# EAGLE design Schematic (EAGLE 5.06)

## Sheet 1 of 3
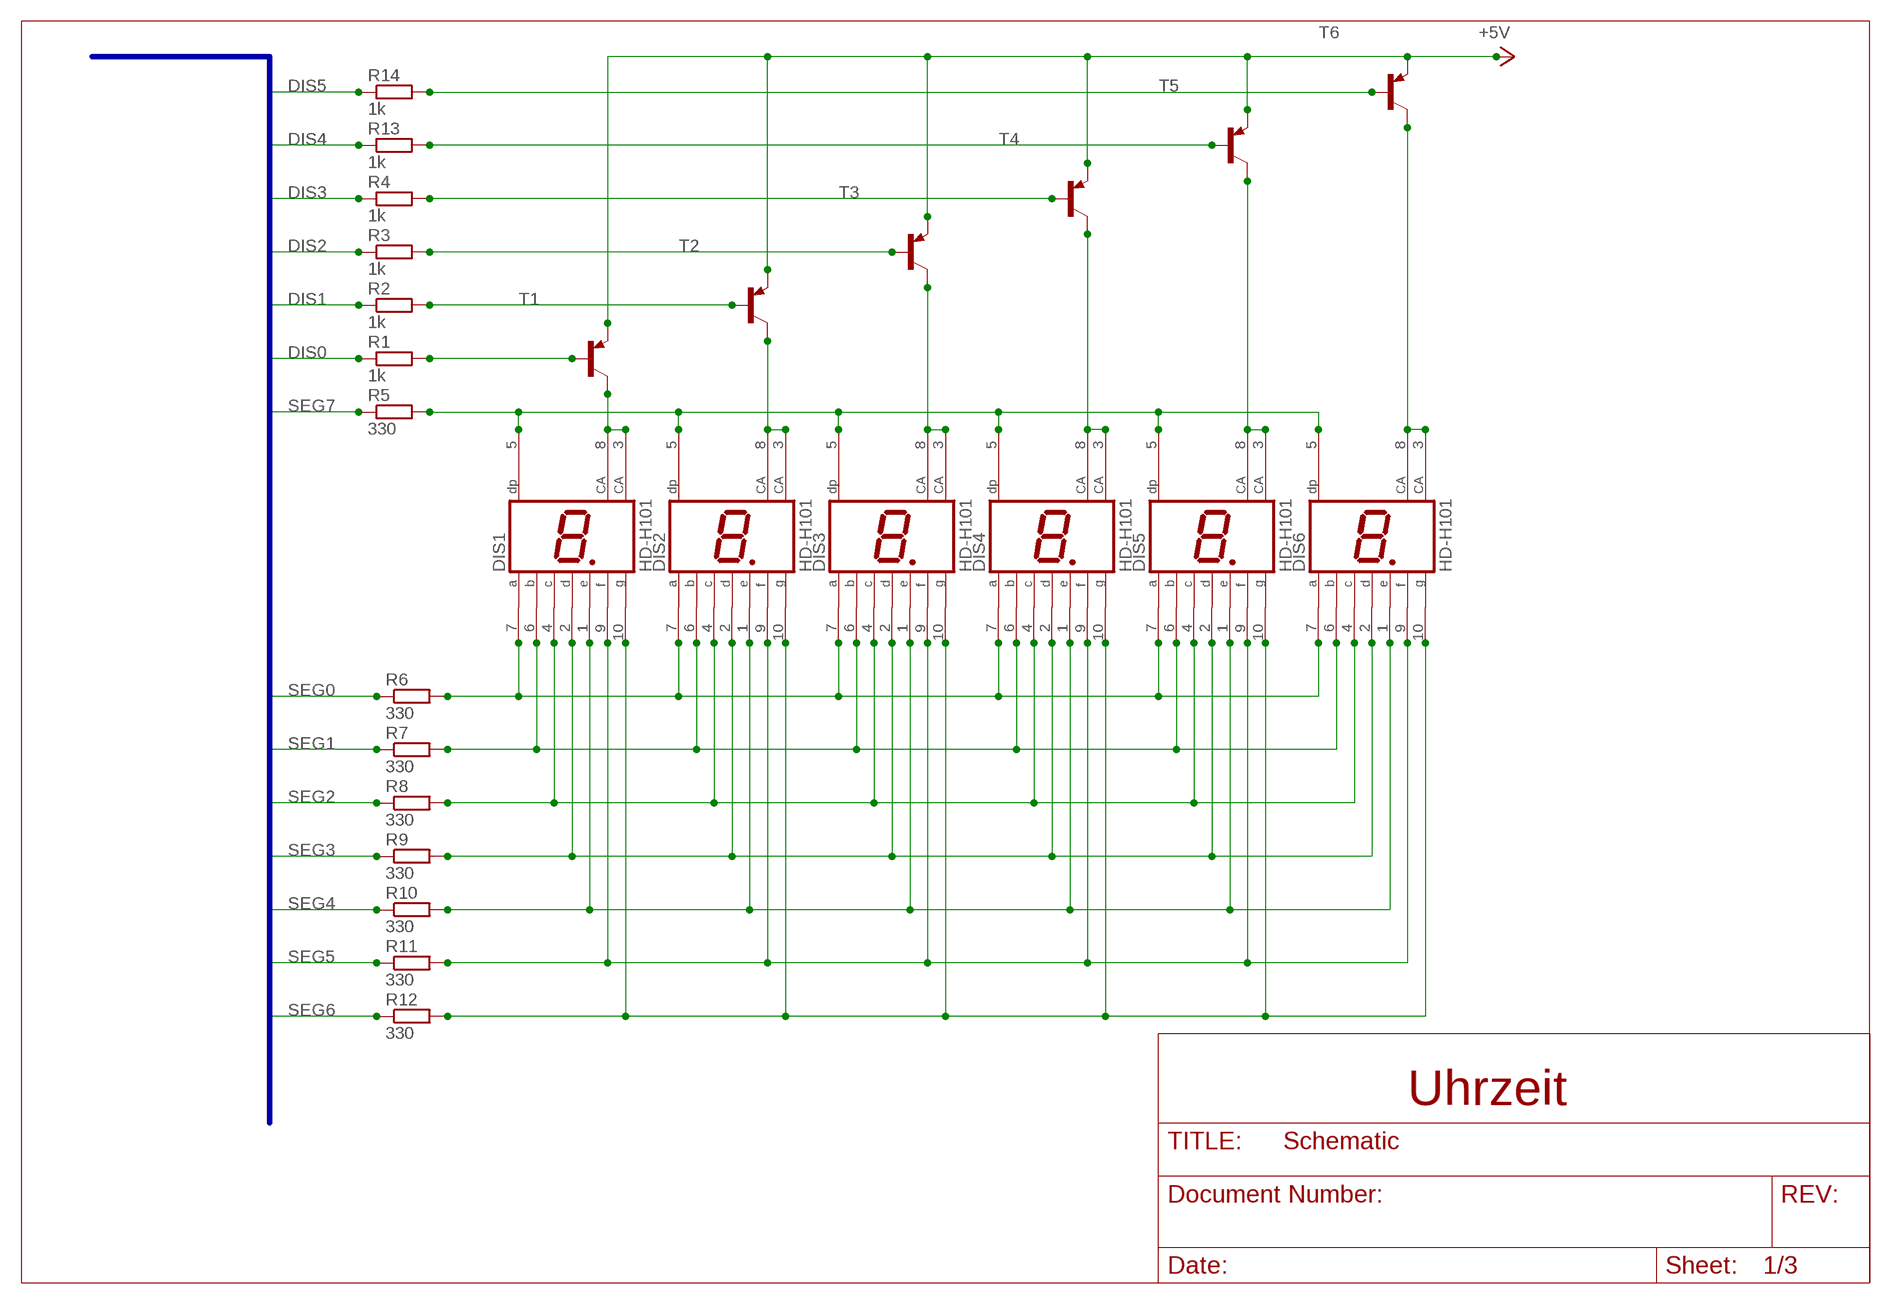
[diagram p0: schematic, sheet 1]

### Parts
DIS1  HD-H101  [HDSP-M]
DIS2  HD-H101  [HDSP-M]
DIS3  HD-H101  [HDSP-M]
DIS4  HD-H101  [HDSP-M]
DIS5  HD-H101  [HDSP-M]
DIS6  HD-H101  [HDSP-M]
R1  1k  R-EU_R1206  [R1206]
R2  1k  R-EU_R1206  [R1206]
R3  1k  R-EU_R1206  [R1206]
R4  1k  R-EU_R1206  [R1206]
R5  330  R-EU_R1206  [R1206]
R6  330  R-EU_R1206  [R1206]
R7  330  R-EU_R1206  [R1206]
R8  330  R-EU_R1206  [R1206]
R9  330  R-EU_R1206  [R1206]
R10  330  R-EU_R1206  [R1206]
R11  330  R-EU_R1206  [R1206]
R12  330  R-EU_R1206  [R1206]
R13  1k  R-EU_R1206  [R1206]
R14  1k  R-EU_R1206  [R1206]
T1  BC857B-PNP-SOT23-BEC  [SOT23-BEC]
T2  BC857B-PNP-SOT23-BEC  [SOT23-BEC]
T3  BC857B-PNP-SOT23-BEC  [SOT23-BEC]
T4  BC857B-PNP-SOT23-BEC  [SOT23-BEC]
T5  BC857B-PNP-SOT23-BEC  [SOT23-BEC]
T6  BC857B-PNP-SOT23-BEC  [SOT23-BEC]

### Nets
+5V: T1.E T2.E T3.E T4.E T5.E T6.E ; also sheet 2,3
DIS0: R1.1 ; also sheet 3
DIS1: R2.1 ; also sheet 3
DIS2: R3.1 ; also sheet 3
DIS3: R4.1 ; also sheet 3
DIS4: R13.1 ; also sheet 3
DIS5: R14.1 ; also sheet 3
N$1: DIS1.3(CA) DIS1.8(CA) T1.C
N$3: DIS2.3(CA) DIS2.8(CA) T2.C
N$5: R4.2 T4.B
N$6: R3.2 T3.B
N$7: R2.2 T2.B
N$8: R1.2 T1.B
N$9: DIS3.3(CA) DIS3.8(CA) T3.C
N$10: DIS1.7(A) DIS2.7(A) DIS3.7(A) DIS4.7(A) DIS5.7(A) DIS6.7(A) R6.2
N$11: DIS1.4(C) DIS2.4(C) DIS3.4(C) DIS4.4(C) DIS5.4(C) DIS6.4(C) R8.2
N$12: DIS1.6(B) DIS2.6(B) DIS3.6(B) DIS4.6(B) DIS5.6(B) DIS6.6(B) R7.2
N$13: DIS1.2(D) DIS2.2(D) DIS3.2(D) DIS4.2(D) DIS5.2(D) DIS6.2(D) R9.2
N$14: DIS1.1(E) DIS2.1(E) DIS3.1(E) DIS4.1(E) DIS5.1(E) DIS6.1(E) R10.2
N$15: DIS1.9(F) DIS2.9(F) DIS3.9(F) DIS4.9(F) DIS5.9(F) DIS6.9(F) R11.2
N$16: DIS1.10(G) DIS2.10(G) DIS3.10(G) DIS4.10(G) DIS5.10(G) DIS6.10(G) R12.2
N$18: DIS4.3(CA) DIS4.8(CA) T4.C
N$19: DIS1.5(DP) DIS2.5(DP) DIS3.5(DP) DIS4.5(DP) DIS5.5(DP) DIS6.5(DP) R5.2
N$20: R14.2 T6.B
N$21: R13.2 T5.B
N$23: DIS5.3(CA) DIS5.8(CA) T5.C
N$25: DIS6.3(CA) DIS6.8(CA) T6.C
SEG0: R6.1 ; also sheet 3
SEG1: R7.1 ; also sheet 3
SEG2: R8.1 ; also sheet 3
SEG3: R9.1 ; also sheet 3
SEG4: R10.1 ; also sheet 3
SEG5: R11.1 ; also sheet 3
SEG6: R12.1 ; also sheet 3
SEG7: R5.1 ; also sheet 3

### Buses
DIS[0..5],SEG[0..7]

### Notes on the sheet
- Uhrzeit

## Sheet 2 of 3
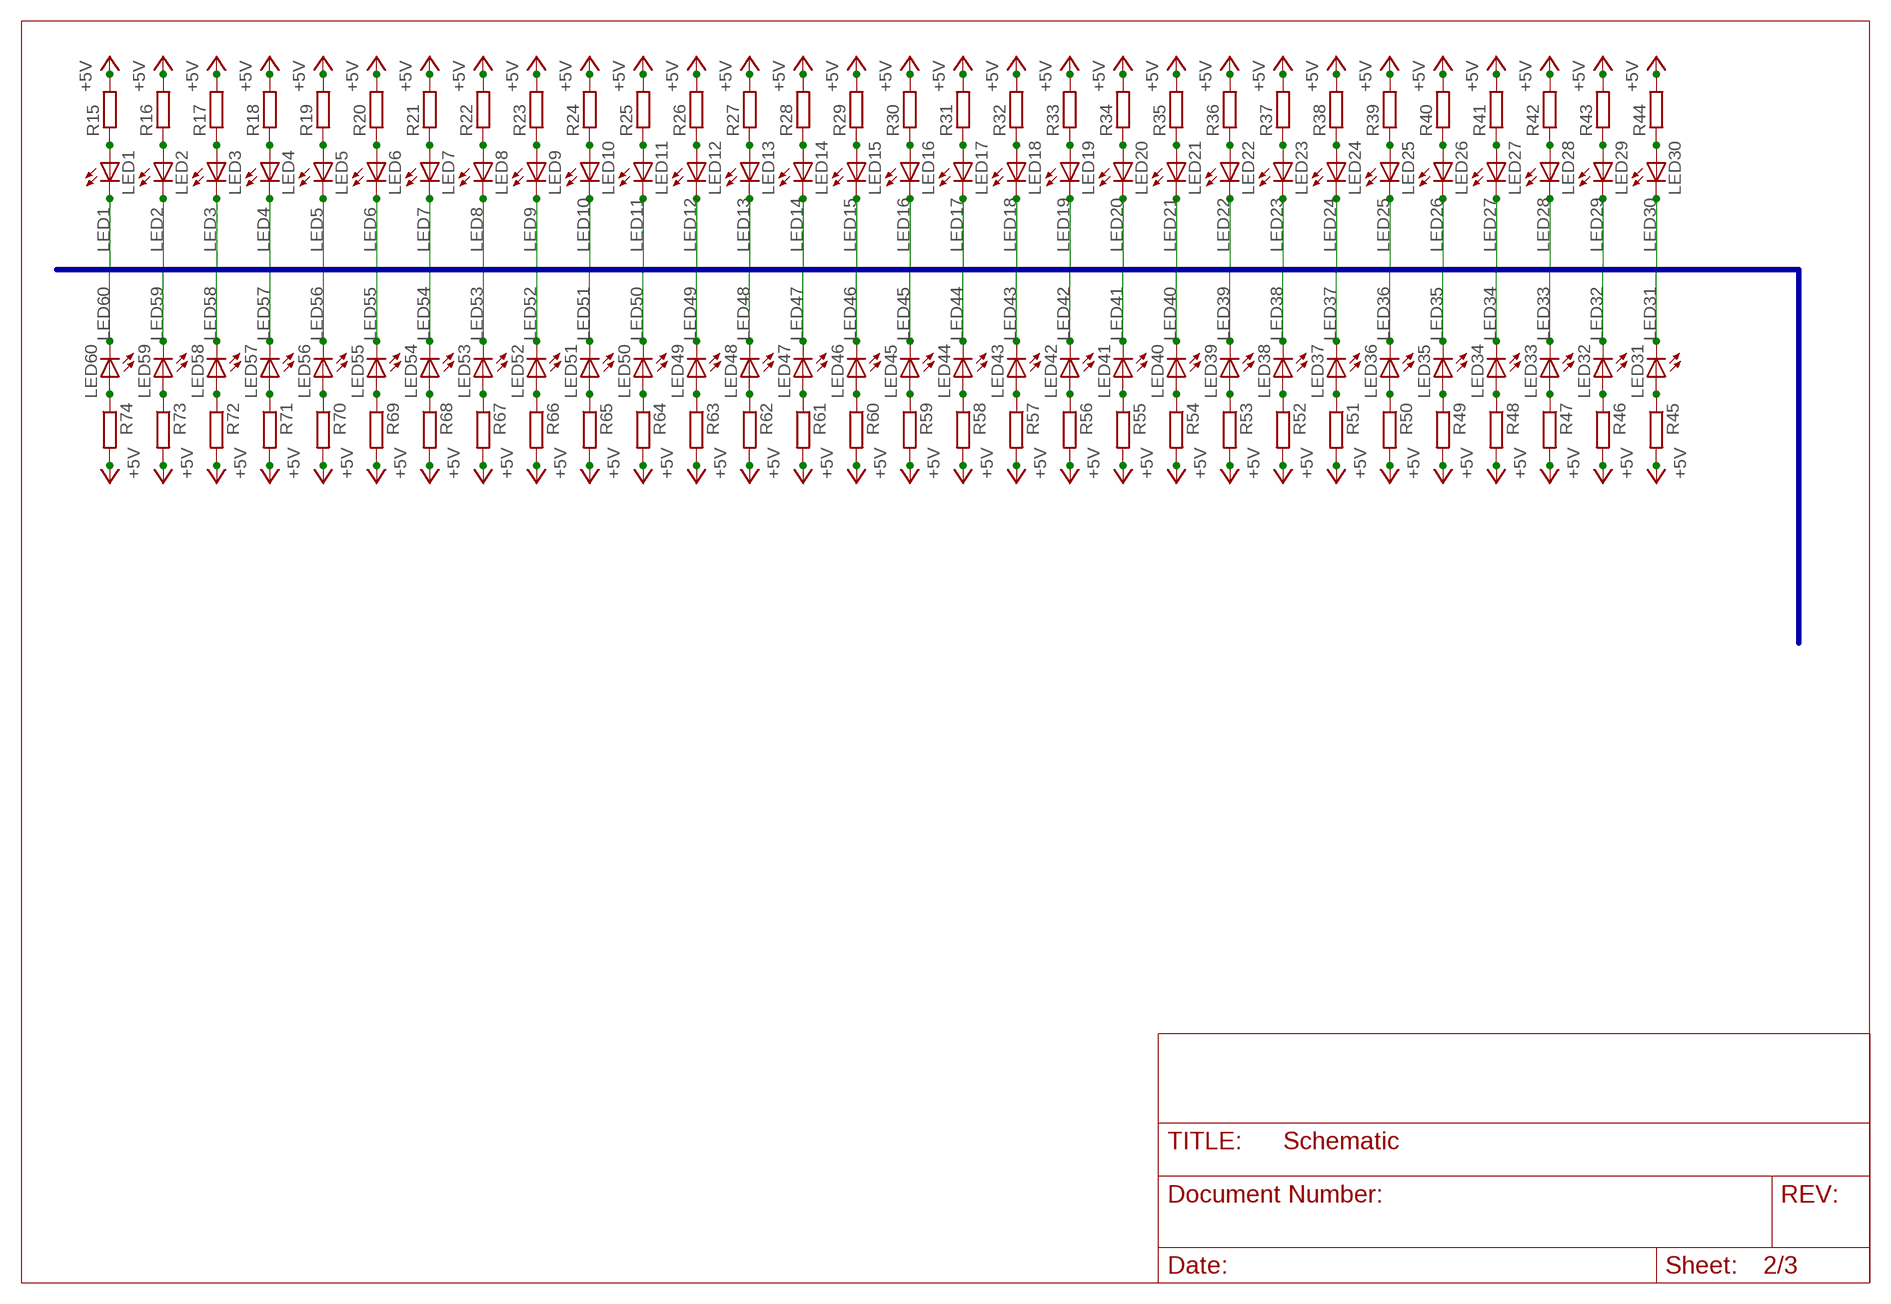
[diagram p1: schematic, sheet 2]

### Parts
LED1  T673  [PLCC2]
LED2  T673  [PLCC2]
LED3  T673  [PLCC2]
LED4  T673  [PLCC2]
LED5  T673  [PLCC2]
LED6  T673  [PLCC2]
LED7  T673  [PLCC2]
LED8  T673  [PLCC2]
LED9  T673  [PLCC2]
LED10  T673  [PLCC2]
LED11  T673  [PLCC2]
LED12  T673  [PLCC2]
LED13  T673  [PLCC2]
LED14  T673  [PLCC2]
LED15  T673  [PLCC2]
LED16  T673  [PLCC2]
LED17  T673  [PLCC2]
LED18  T673  [PLCC2]
LED19  T673  [PLCC2]
LED20  T673  [PLCC2]
LED21  T673  [PLCC2]
LED22  T673  [PLCC2]
LED23  T673  [PLCC2]
LED24  T673  [PLCC2]
LED25  T673  [PLCC2]
LED26  T673  [PLCC2]
LED27  T673  [PLCC2]
LED28  T673  [PLCC2]
LED29  T673  [PLCC2]
LED30  T673  [PLCC2]
LED31  T673  [PLCC2]
LED32  T673  [PLCC2]
LED33  T673  [PLCC2]
LED34  T673  [PLCC2]
LED35  T673  [PLCC2]
LED36  T673  [PLCC2]
LED37  T673  [PLCC2]
LED38  T673  [PLCC2]
LED39  T673  [PLCC2]
LED40  T673  [PLCC2]
LED41  T673  [PLCC2]
LED42  T673  [PLCC2]
LED43  T673  [PLCC2]
LED44  T673  [PLCC2]
LED45  T673  [PLCC2]
LED46  T673  [PLCC2]
LED47  T673  [PLCC2]
LED48  T673  [PLCC2]
LED49  T673  [PLCC2]
LED50  T673  [PLCC2]
LED51  T673  [PLCC2]
LED52  T673  [PLCC2]
LED53  T673  [PLCC2]
LED54  T673  [PLCC2]
LED55  T673  [PLCC2]
LED56  T673  [PLCC2]
LED57  T673  [PLCC2]
LED58  T673  [PLCC2]
LED59  T673  [PLCC2]
LED60  T673  [PLCC2]
R15  R-EU_M1206  [M1206]
R16  R-EU_M1206  [M1206]
R17  R-EU_M1206  [M1206]
R18  R-EU_M1206  [M1206]
R19  R-EU_M1206  [M1206]
R20  R-EU_M1206  [M1206]
R21  R-EU_M1206  [M1206]
R22  R-EU_M1206  [M1206]
R23  R-EU_M1206  [M1206]
R24  R-EU_M1206  [M1206]
R25  R-EU_M1206  [M1206]
R26  R-EU_M1206  [M1206]
R27  R-EU_M1206  [M1206]
R28  R-EU_M1206  [M1206]
R29  R-EU_M1206  [M1206]
R30  R-EU_M1206  [M1206]
R31  R-EU_M1206  [M1206]
R32  R-EU_M1206  [M1206]
R33  R-EU_M1206  [M1206]
R34  R-EU_M1206  [M1206]
R35  R-EU_M1206  [M1206]
R36  R-EU_M1206  [M1206]
R37  R-EU_M1206  [M1206]
R38  R-EU_M1206  [M1206]
R39  R-EU_M1206  [M1206]
R40  R-EU_M1206  [M1206]
R41  R-EU_M1206  [M1206]
R42  R-EU_M1206  [M1206]
R43  R-EU_M1206  [M1206]
R44  R-EU_M1206  [M1206]
R45  R-EU_M1206  [M1206]
R46  R-EU_M1206  [M1206]
R47  R-EU_M1206  [M1206]
R48  R-EU_M1206  [M1206]
R49  R-EU_M1206  [M1206]
R50  R-EU_M1206  [M1206]
R51  R-EU_M1206  [M1206]
R52  R-EU_M1206  [M1206]
R53  R-EU_M1206  [M1206]
R54  R-EU_M1206  [M1206]
R55  R-EU_M1206  [M1206]
R56  R-EU_M1206  [M1206]
R57  R-EU_M1206  [M1206]
R58  R-EU_M1206  [M1206]
R59  R-EU_M1206  [M1206]
R60  R-EU_M1206  [M1206]
R61  R-EU_M1206  [M1206]
R62  R-EU_M1206  [M1206]
R63  R-EU_M1206  [M1206]
R64  R-EU_M1206  [M1206]
R65  R-EU_M1206  [M1206]
R66  R-EU_M1206  [M1206]
R67  R-EU_M1206  [M1206]
R68  R-EU_M1206  [M1206]
R69  R-EU_M1206  [M1206]
R70  R-EU_M1206  [M1206]
R71  R-EU_M1206  [M1206]
R72  R-EU_M1206  [M1206]
R73  R-EU_M1206  [M1206]
R74  R-EU_M1206  [M1206]

### Nets
+5V: R15.2 R16.2 R17.2 R18.2 R19.2 R20.2 R21.2 R22.2 R23.2 R24.2 R25.2 R26.2 R27.2 R28.2 R29.2 R30.2 R31.2 R32.2 R33.2 R34.2 R35.2 R36.2 R37.2 R38.2 R39.2 R40.2 R41.2 R42.2 R43.2 R44.2 R45.2 R46.2 R47.2 R48.2 R49.2 R50.2 R51.2 R52.2 R53.2 R54.2 R55.2 R56.2 R57.2 R58.2 R59.2 R60.2 R61.2 R62.2 R63.2 R64.2 R65.2 R66.2 R67.2 R68.2 R69.2 R70.2 R71.2 R72.2 R73.2 R74.2 ; also sheet 1,3
LED1: LED1.C ; also sheet 3
LED2: LED2.C ; also sheet 3
LED3: LED3.C ; also sheet 3
LED4: LED4.C ; also sheet 3
LED5: LED5.C ; also sheet 3
LED6: LED6.C ; also sheet 3
LED7: LED7.C ; also sheet 3
LED8: LED8.C ; also sheet 3
LED9: LED9.C ; also sheet 3
LED10: LED10.C ; also sheet 3
LED11: LED11.C ; also sheet 3
LED12: LED12.C ; also sheet 3
LED13: LED13.C ; also sheet 3
LED14: LED14.C ; also sheet 3
LED15: LED15.C ; also sheet 3
LED16: LED16.C ; also sheet 3
LED17: LED17.C ; also sheet 3
LED18: LED18.C ; also sheet 3
LED19: LED19.C ; also sheet 3
LED20: LED20.C ; also sheet 3
LED21: LED21.C ; also sheet 3
LED22: LED22.C ; also sheet 3
LED23: LED23.C ; also sheet 3
LED24: LED24.C ; also sheet 3
LED25: LED25.C ; also sheet 3
LED26: LED26.C ; also sheet 3
LED27: LED27.C ; also sheet 3
LED28: LED28.C ; also sheet 3
LED29: LED29.C ; also sheet 3
LED30: LED30.C ; also sheet 3
LED31: LED31.C ; also sheet 3
LED32: LED32.C ; also sheet 3
LED33: LED33.C ; also sheet 3
LED34: LED34.C ; also sheet 3
LED35: LED35.C ; also sheet 3
LED36: LED36.C ; also sheet 3
LED37: LED37.C ; also sheet 3
LED38: LED38.C ; also sheet 3
LED39: LED39.C ; also sheet 3
LED40: LED40.C ; also sheet 3
LED41: LED41.C ; also sheet 3
LED42: LED42.C ; also sheet 3
LED43: LED43.C ; also sheet 3
LED44: LED44.C ; also sheet 3
LED45: LED45.C ; also sheet 3
LED46: LED46.C ; also sheet 3
LED47: LED47.C ; also sheet 3
LED48: LED48.C ; also sheet 3
LED49: LED49.C ; also sheet 3
LED50: LED50.C ; also sheet 3
LED51: LED51.C ; also sheet 3
LED52: LED52.C ; also sheet 3
LED53: LED53.C ; also sheet 3
LED54: LED54.C ; also sheet 3
LED55: LED55.C ; also sheet 3
LED56: LED56.C ; also sheet 3
LED57: LED57.C ; also sheet 3
LED58: LED58.C ; also sheet 3
LED59: LED59.C ; also sheet 3
LED60: LED60.C ; also sheet 3
N$2: LED2.A R16.1
N$4: LED1.A R15.1
N$22: LED3.A R17.1
N$24: LED4.A R18.1
N$26: LED5.A R19.1
N$27: LED6.A R20.1
N$28: LED7.A R21.1
N$29: LED8.A R22.1
N$30: LED9.A R23.1
N$31: LED10.A R24.1
N$32: LED11.A R25.1
N$33: LED12.A R26.1
N$34: LED13.A R27.1
N$35: LED14.A R28.1
N$36: LED15.A R29.1
N$37: LED16.A R30.1
N$38: LED17.A R31.1
N$39: LED18.A R32.1
N$40: LED19.A R33.1
N$41: LED20.A R34.1
N$42: LED21.A R35.1
N$43: LED22.A R36.1
N$44: LED23.A R37.1
N$45: LED24.A R38.1
N$46: LED25.A R39.1
N$47: LED26.A R40.1
N$48: LED27.A R41.1
N$49: LED28.A R42.1
N$50: LED29.A R43.1
N$51: LED30.A R44.1
N$52: LED31.A R45.1
N$53: LED32.A R46.1
N$54: LED33.A R47.1
N$55: LED34.A R48.1
N$56: LED35.A R49.1
N$57: LED36.A R50.1
N$58: LED37.A R51.1
N$59: LED38.A R52.1
N$60: LED39.A R53.1
N$61: LED40.A R54.1
N$62: LED41.A R55.1
N$63: LED42.A R56.1
N$64: LED43.A R57.1
N$65: LED44.A R58.1
N$66: LED45.A R59.1
N$67: LED46.A R60.1
N$68: LED47.A R61.1
N$69: LED48.A R62.1
N$70: LED49.A R63.1
N$71: LED50.A R64.1
N$72: LED51.A R65.1
N$73: LED52.A R66.1
N$74: LED53.A R67.1
N$75: LED54.A R68.1
N$76: LED55.A R69.1
N$77: LED56.A R70.1
N$78: LED57.A R71.1
N$79: LED58.A R72.1
N$80: LED59.A R73.1
N$81: LED60.A R74.1

### Buses
LED[1..60]

## Sheet 3 of 3
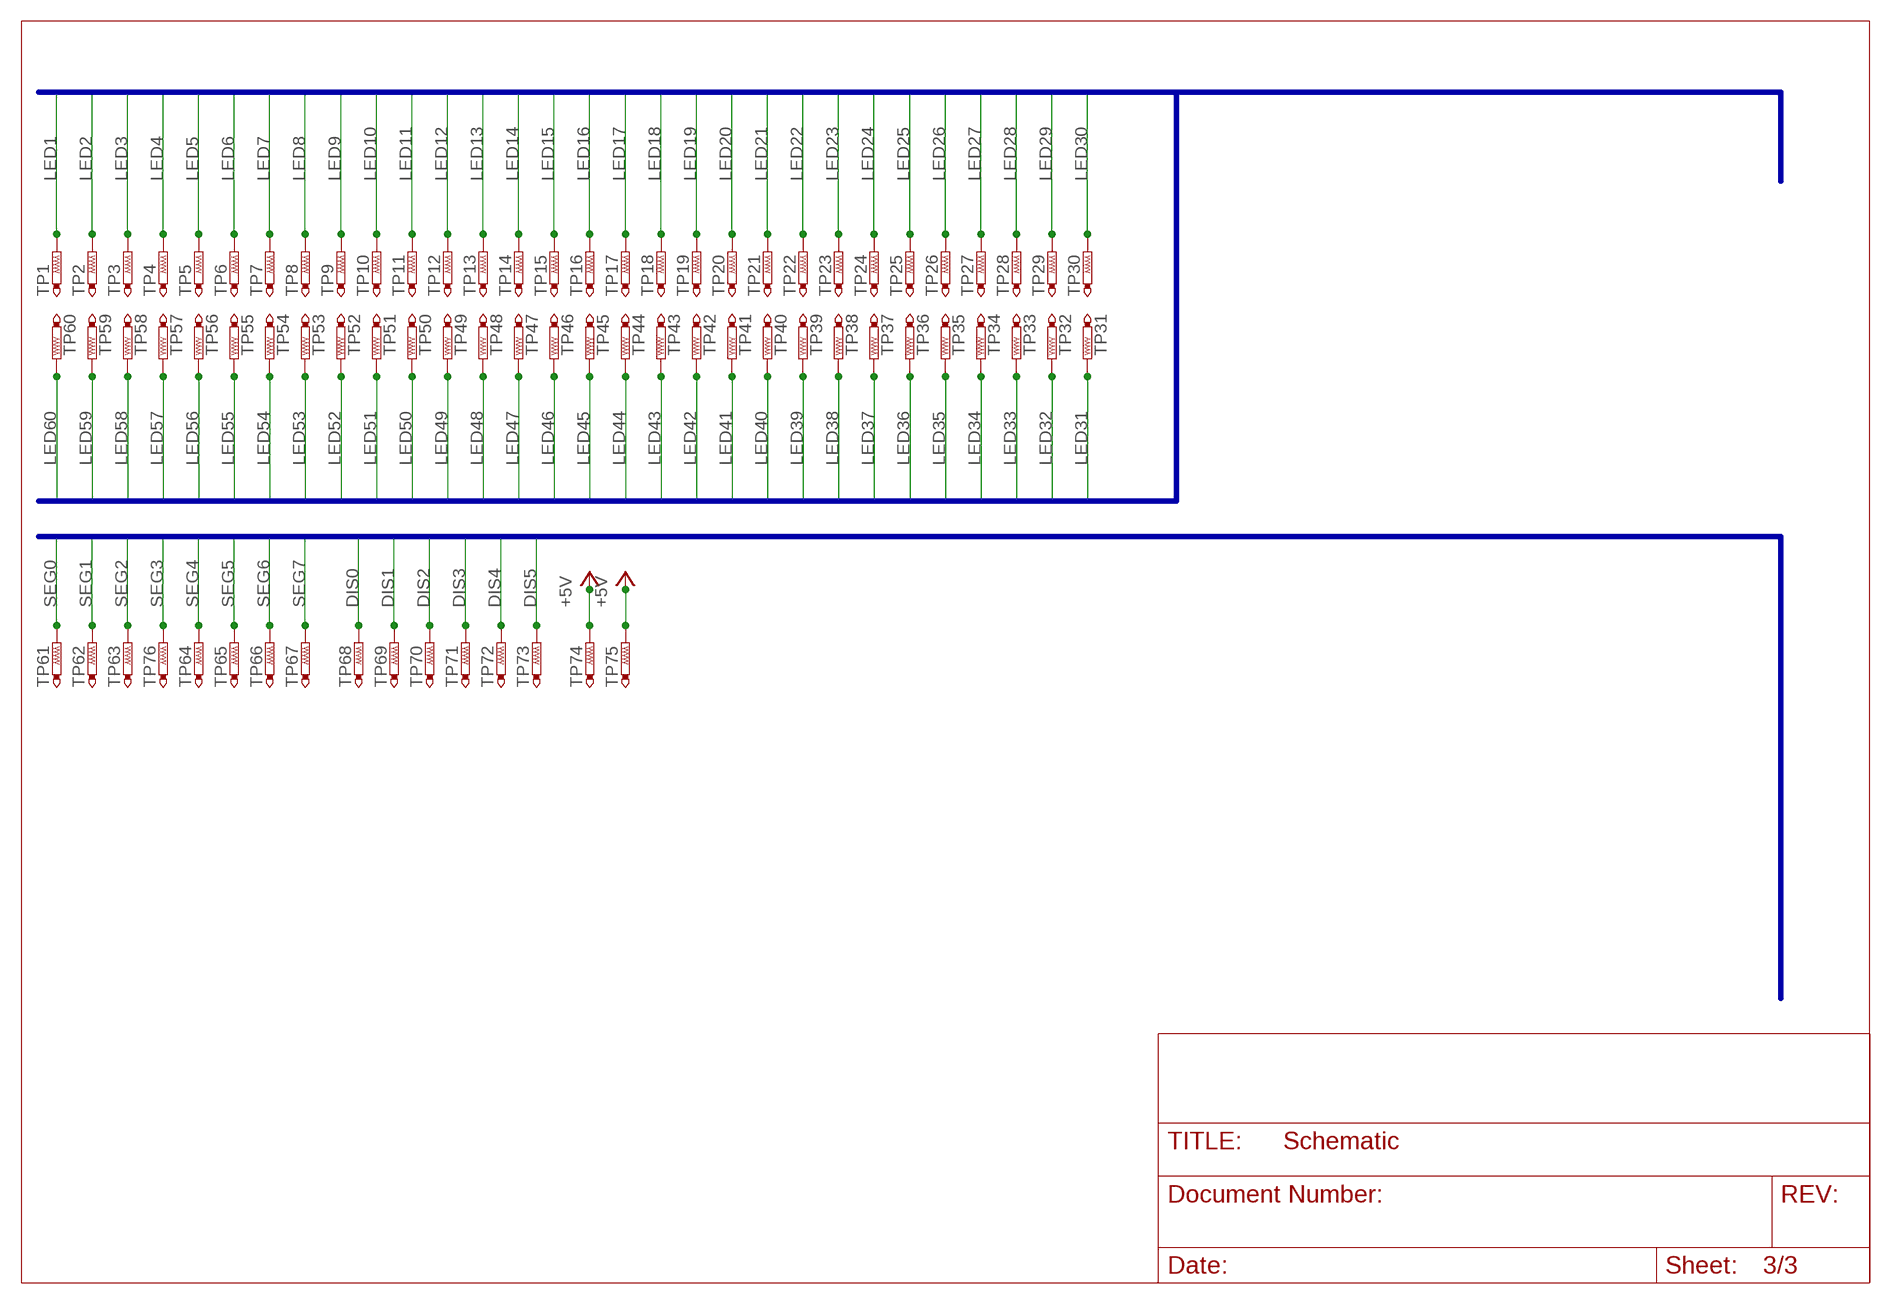
[diagram p2: schematic, sheet 3]

### Parts
TP1  PTR1PAD1-13Y  [P1-13Y]
TP2  PTR1PAD1-13Y  [P1-13Y]
TP3  PTR1PAD1-13Y  [P1-13Y]
TP4  PTR1PAD1-13Y  [P1-13Y]
TP5  PTR1PAD1-13Y  [P1-13Y]
TP6  PTR1PAD1-13Y  [P1-13Y]
TP7  PTR1PAD1-13Y  [P1-13Y]
TP8  PTR1PAD1-13Y  [P1-13Y]
TP9  PTR1PAD1-13Y  [P1-13Y]
TP10  PTR1PAD1-13Y  [P1-13Y]
TP11  PTR1PAD1-13Y  [P1-13Y]
TP12  PTR1PAD1-13Y  [P1-13Y]
TP13  PTR1PAD1-13Y  [P1-13Y]
TP14  PTR1PAD1-13Y  [P1-13Y]
TP15  PTR1PAD1-13Y  [P1-13Y]
TP16  PTR1PAD1-13Y  [P1-13Y]
TP17  PTR1PAD1-13Y  [P1-13Y]
TP18  PTR1PAD1-13Y  [P1-13Y]
TP19  PTR1PAD1-13Y  [P1-13Y]
TP20  PTR1PAD1-13Y  [P1-13Y]
TP21  PTR1PAD1-13Y  [P1-13Y]
TP22  PTR1PAD1-13Y  [P1-13Y]
TP23  PTR1PAD1-13Y  [P1-13Y]
TP24  PTR1PAD1-13Y  [P1-13Y]
TP25  PTR1PAD1-13Y  [P1-13Y]
TP26  PTR1PAD1-13Y  [P1-13Y]
TP27  PTR1PAD1-13Y  [P1-13Y]
TP28  PTR1PAD1-13Y  [P1-13Y]
TP29  PTR1PAD1-13Y  [P1-13Y]
TP30  PTR1PAD1-13Y  [P1-13Y]
TP31  PTR1PAD1-13Y  [P1-13Y]
TP32  PTR1PAD1-13Y  [P1-13Y]
TP33  PTR1PAD1-13Y  [P1-13Y]
TP34  PTR1PAD1-13Y  [P1-13Y]
TP35  PTR1PAD1-13Y  [P1-13Y]
TP36  PTR1PAD1-13Y  [P1-13Y]
TP37  PTR1PAD1-13Y  [P1-13Y]
TP38  PTR1PAD1-13Y  [P1-13Y]
TP39  PTR1PAD1-13Y  [P1-13Y]
TP40  PTR1PAD1-13Y  [P1-13Y]
TP41  PTR1PAD1-13Y  [P1-13Y]
TP42  PTR1PAD1-13Y  [P1-13Y]
TP43  PTR1PAD1-13Y  [P1-13Y]
TP44  PTR1PAD1-13Y  [P1-13Y]
TP45  PTR1PAD1-13Y  [P1-13Y]
TP46  PTR1PAD1-13Y  [P1-13Y]
TP47  PTR1PAD1-13Y  [P1-13Y]
TP48  PTR1PAD1-13Y  [P1-13Y]
TP49  PTR1PAD1-13Y  [P1-13Y]
TP50  PTR1PAD1-13Y  [P1-13Y]
TP51  PTR1PAD1-13Y  [P1-13Y]
TP52  PTR1PAD1-13Y  [P1-13Y]
TP53  PTR1PAD1-13Y  [P1-13Y]
TP54  PTR1PAD1-13Y  [P1-13Y]
TP55  PTR1PAD1-13Y  [P1-13Y]
TP56  PTR1PAD1-13Y  [P1-13Y]
TP57  PTR1PAD1-13Y  [P1-13Y]
TP58  PTR1PAD1-13Y  [P1-13Y]
TP59  PTR1PAD1-13Y  [P1-13Y]
TP60  PTR1PAD1-13Y  [P1-13Y]
TP61  PTR1PAD1-13Y  [P1-13Y]
TP62  PTR1PAD1-13Y  [P1-13Y]
TP63  PTR1PAD1-13Y  [P1-13Y]
TP64  PTR1PAD1-13Y  [P1-13Y]
TP65  PTR1PAD1-13Y  [P1-13Y]
TP66  PTR1PAD1-13Y  [P1-13Y]
TP67  PTR1PAD1-13Y  [P1-13Y]
TP68  PTR1PAD1-13Y  [P1-13Y]
TP69  PTR1PAD1-13Y  [P1-13Y]
TP70  PTR1PAD1-13Y  [P1-13Y]
TP71  PTR1PAD1-13Y  [P1-13Y]
TP72  PTR1PAD1-13Y  [P1-13Y]
TP73  PTR1PAD1-13Y  [P1-13Y]
TP74  PTR1PAD1-13Y  [P1-13Y]
TP75  PTR1PAD1-13Y  [P1-13Y]
TP76  PTR1PAD1-13Y  [P1-13Y]

### Nets
+5V: TP74.1(TP) TP75.1(TP) ; also sheet 1,2
DIS0: TP68.1(TP) ; also sheet 1
DIS1: TP69.1(TP) ; also sheet 1
DIS2: TP70.1(TP) ; also sheet 1
DIS3: TP71.1(TP) ; also sheet 1
DIS4: TP72.1(TP) ; also sheet 1
DIS5: TP73.1(TP) ; also sheet 1
LED1: TP1.1(TP) ; also sheet 2
LED2: TP2.1(TP) ; also sheet 2
LED3: TP3.1(TP) ; also sheet 2
LED4: TP4.1(TP) ; also sheet 2
LED5: TP5.1(TP) ; also sheet 2
LED6: TP6.1(TP) ; also sheet 2
LED7: TP7.1(TP) ; also sheet 2
LED8: TP8.1(TP) ; also sheet 2
LED9: TP9.1(TP) ; also sheet 2
LED10: TP10.1(TP) ; also sheet 2
LED11: TP11.1(TP) ; also sheet 2
LED12: TP12.1(TP) ; also sheet 2
LED13: TP13.1(TP) ; also sheet 2
LED14: TP14.1(TP) ; also sheet 2
LED15: TP15.1(TP) ; also sheet 2
LED16: TP16.1(TP) ; also sheet 2
LED17: TP17.1(TP) ; also sheet 2
LED18: TP18.1(TP) ; also sheet 2
LED19: TP19.1(TP) ; also sheet 2
LED20: TP20.1(TP) ; also sheet 2
LED21: TP21.1(TP) ; also sheet 2
LED22: TP22.1(TP) ; also sheet 2
LED23: TP23.1(TP) ; also sheet 2
LED24: TP24.1(TP) ; also sheet 2
LED25: TP25.1(TP) ; also sheet 2
LED26: TP26.1(TP) ; also sheet 2
LED27: TP27.1(TP) ; also sheet 2
LED28: TP28.1(TP) ; also sheet 2
LED29: TP29.1(TP) ; also sheet 2
LED30: TP30.1(TP) ; also sheet 2
LED31: TP31.1(TP) ; also sheet 2
LED32: TP32.1(TP) ; also sheet 2
LED33: TP33.1(TP) ; also sheet 2
LED34: TP34.1(TP) ; also sheet 2
LED35: TP35.1(TP) ; also sheet 2
LED36: TP36.1(TP) ; also sheet 2
LED37: TP37.1(TP) ; also sheet 2
LED38: TP38.1(TP) ; also sheet 2
LED39: TP39.1(TP) ; also sheet 2
LED40: TP40.1(TP) ; also sheet 2
LED41: TP41.1(TP) ; also sheet 2
LED42: TP42.1(TP) ; also sheet 2
LED43: TP43.1(TP) ; also sheet 2
LED44: TP44.1(TP) ; also sheet 2
LED45: TP45.1(TP) ; also sheet 2
LED46: TP46.1(TP) ; also sheet 2
LED47: TP47.1(TP) ; also sheet 2
LED48: TP48.1(TP) ; also sheet 2
LED49: TP49.1(TP) ; also sheet 2
LED50: TP50.1(TP) ; also sheet 2
LED51: TP51.1(TP) ; also sheet 2
LED52: TP52.1(TP) ; also sheet 2
LED53: TP53.1(TP) ; also sheet 2
LED54: TP54.1(TP) ; also sheet 2
LED55: TP55.1(TP) ; also sheet 2
LED56: TP56.1(TP) ; also sheet 2
LED57: TP57.1(TP) ; also sheet 2
LED58: TP58.1(TP) ; also sheet 2
LED59: TP59.1(TP) ; also sheet 2
LED60: TP60.1(TP) ; also sheet 2
SEG0: TP61.1(TP) ; also sheet 1
SEG1: TP62.1(TP) ; also sheet 1
SEG2: TP63.1(TP) ; also sheet 1
SEG3: TP76.1(TP) ; also sheet 1
SEG4: TP64.1(TP) ; also sheet 1
SEG5: TP65.1(TP) ; also sheet 1
SEG6: TP66.1(TP) ; also sheet 1
SEG7: TP67.1(TP) ; also sheet 1

### Buses
LED[1..60]
DIS[0..5],SEG[0..7]

## Library data of the parts
DIS1-DIS6 = display-hp:HD-H101: LED DISPLAY 1-character 7 segment, decimal point right
LED1-LED60 = extra_dev:T673
R1-R74 = rcl:R-EU_: RESISTOR, European symbol
T1-T6 = transistor:*-PNP-: PNP Transistror
TP1-TP76 = testpad:PTR1: TEST PIN

## Board
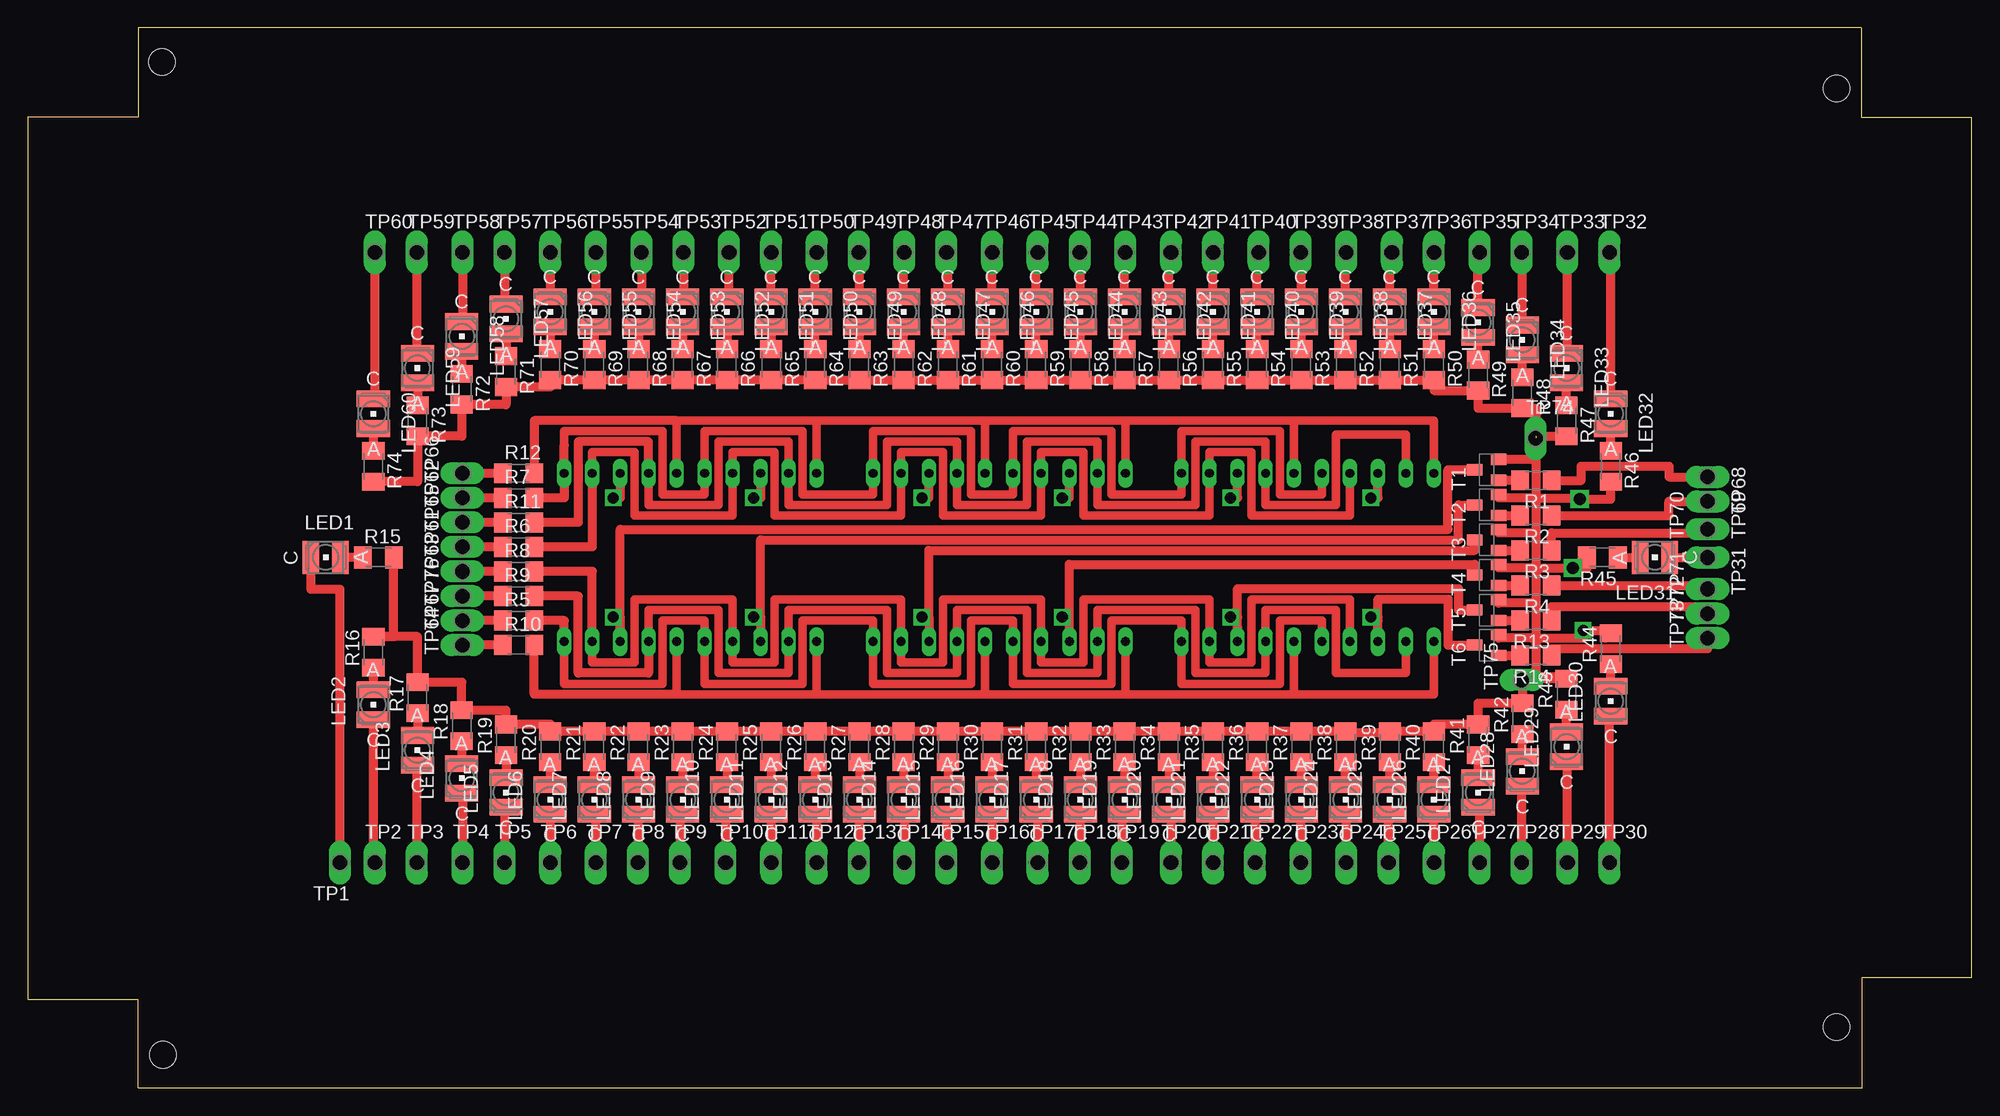
[diagram p3: board, top side]
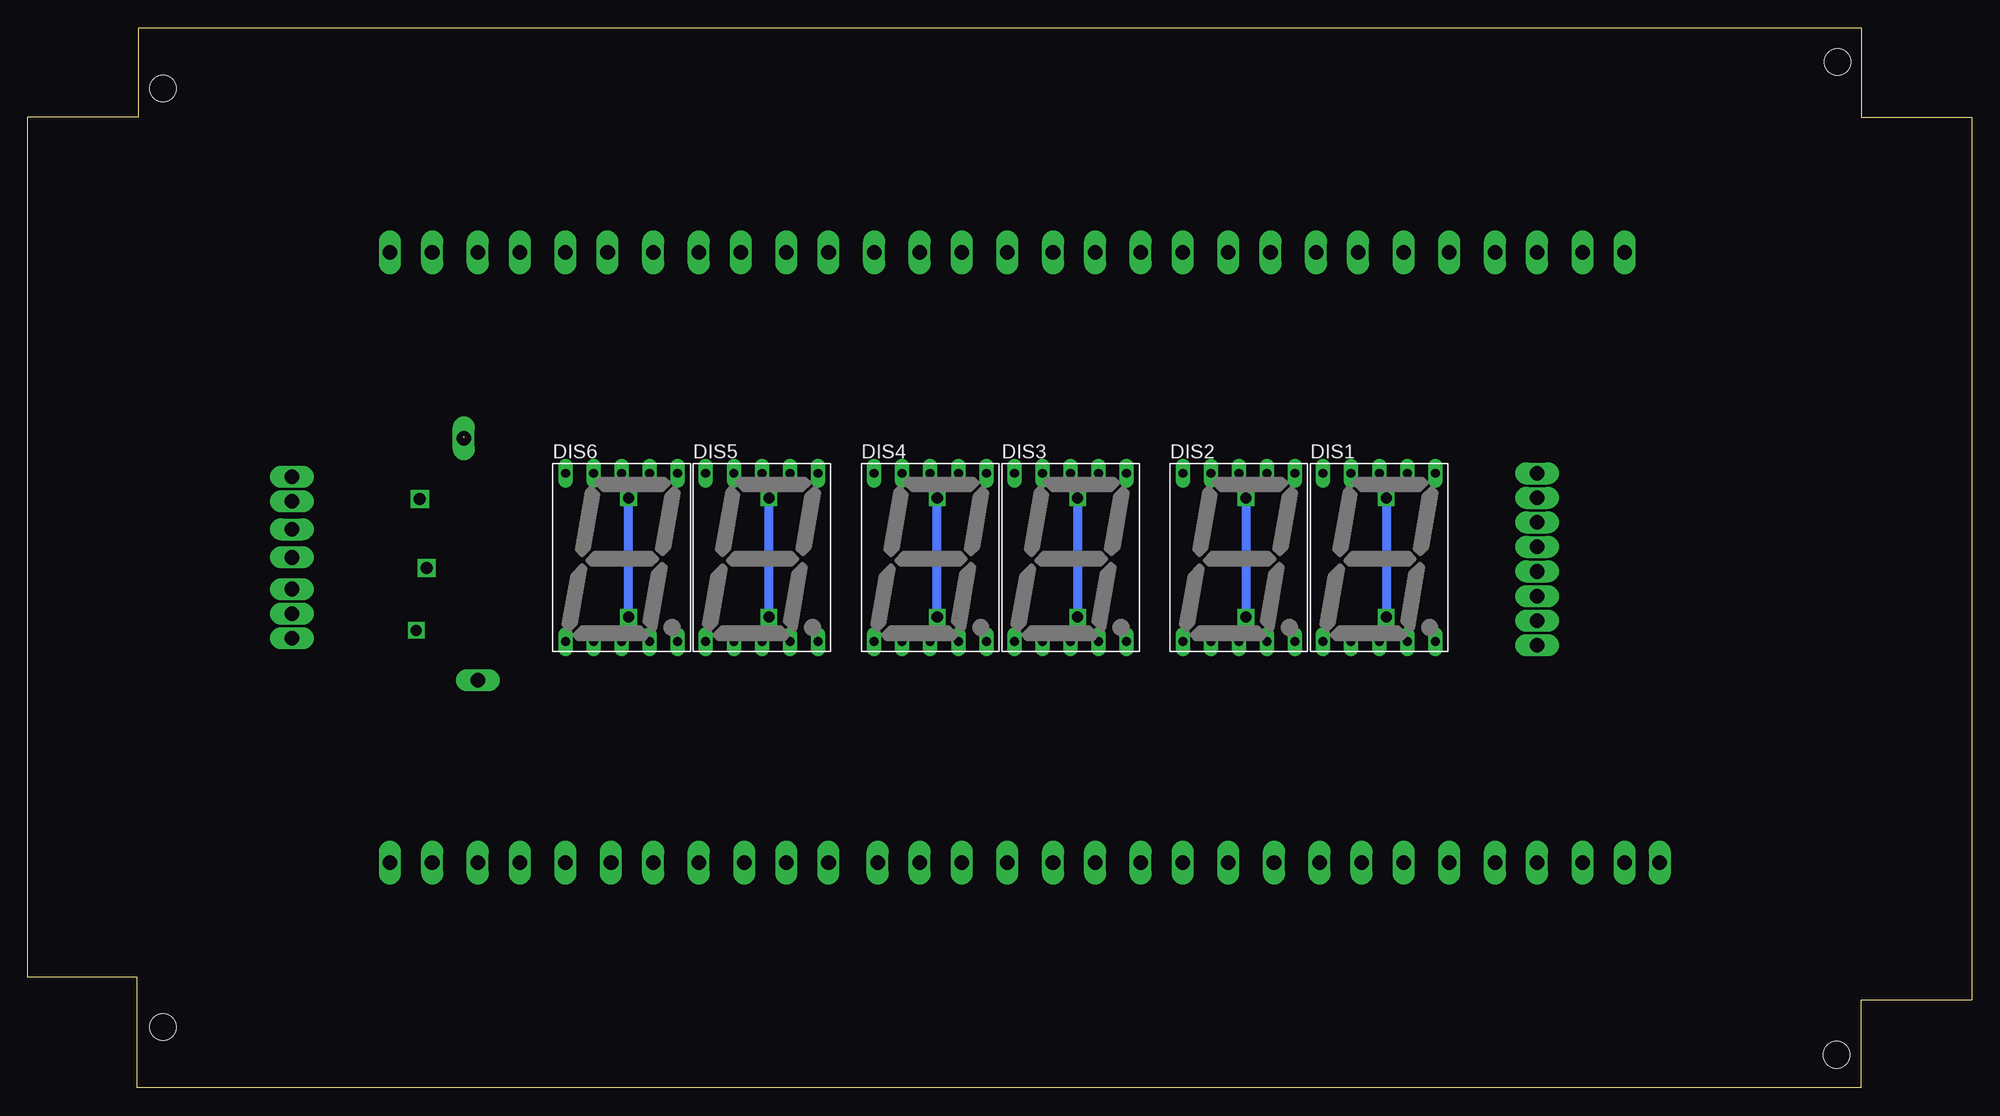
[diagram p4: board, bottom side, seen from below]

Size 176 x 96 mm. Coordinates in mm from the lower left corner, seen from the top.
Outline: 10,0 166.1,0 166.1,10 176,10 176,87.9 166,87.9 166,96 10,96 10,87.9 0,87.9 0,8 10,8 10,0
Copper layers (1*16): Top 0.035mm / dielectric 1.5mm / Bottom 0.035mm
Design rules "default": minimum track width 10mil, minimum drill 24mil, track to track 8mil, track to pad 8mil, pad to pad 8mil, via to via 8mil, smd to smd 8mil, copper to edge 40mil, drill to drill 8mil, minimum pad ring 10mil, minimum via ring 8mil, stop-mask expansion 4mil, vias tented up to drill 0mil, thermal gap 10mil
Holes 2.4 mm at 12.25,3 12.15,92.9 163.75,90.5 163.75,5.5

### Footprints (pad centres in the part's own frame; a part is rotated, then mirrored left to right if it is on the bottom)
HDSP-M = drill 0.813 long: 1 -5.08,-7.62; 2 -2.54,-7.62; 3 0,-7.62; 4 2.54,-7.62; 5 5.08,-7.62; 6 5.08,7.62; 7 2.54,7.62; 8 0,7.62; 9 -2.54,7.62; 10 -5.08,7.62
PLCC2 = smd 3 x 1.5: A 0,1.35; C 0,-1.35
R1206 = smd 1.6 x 1.803: 1 -1.422,0; 2 1.422,0
M1206 = smd 1.6 x 2: 1 -1.4,0; 2 1.4,0
SOT23-BEC = smd 1 x 1.4: B -0.95,-1.1; C 0,1.1; E 0.95,-1.1
P1-13Y = drill 1.321 pad 1.905 long: 1 0,0

### Placement (x,y rotation side)
DIS1  53.65,48.03 0 bottom
DIS2  66.35,48.03 0 bottom
DIS3  81.59,48.03 0 bottom
DIS4  94.29,48.03 0 bottom
DIS5  109.53,48.03 0 bottom
DIS6  122.23,48.03 0 bottom
LED1  26.98,48.03 270 top
LED2  31.3,34.69 0 top
LED3  35.3,30.57 0 top
LED4  39.3,28.02 0 top
LED5  43.3,26.75 0 top
LED6  47.3,26.12 0 top
LED7  51.3,26.12 0 top
LED8  55.3,26.12 0 top
LED9  59.3,26.12 0 top
LED10  63.3,26.12 0 top
LED11  67.3,26.12 0 top
LED12  71.3,26.12 0 top
LED13  75.3,26.12 0 top
LED14  79.3,26.12 0 top
LED15  83.3,26.12 0 top
LED16  87.3,26.12 0 top
LED17  91.3,26.12 0 top
LED18  95.3,26.12 0 top
LED19  99.3,26.12 0 top
LED20  103.3,26.12 0 top
LED21  107.3,26.12 0 top
LED22  111.3,26.12 0 top
LED23  115.3,26.12 0 top
LED24  119.3,26.12 0 top
LED25  123.3,26.12 0 top
LED26  127.3,26.12 0 top
LED27  131.3,26.75 0 top
LED28  135.3,28.66 0 top
LED29  139.3,30.88 0 top
LED30  143.3,35.01 0 top
LED31  147.3,48.03 90 top
LED32  143.3,61.05 180 top
LED33  139.3,65.17 180 top
LED34  135.3,67.71 180 top
LED35  131.3,69.3 180 top
LED36  127.3,70.25 180 top
LED37  123.3,70.25 180 top
LED38  119.3,70.25 180 top
LED39  115.3,70.25 180 top
LED40  111.3,70.25 180 top
LED41  107.3,70.25 180 top
LED42  103.3,70.25 180 top
LED43  99.3,70.25 180 top
LED44  95.3,70.25 180 top
LED45  91.3,70.25 180 top
LED46  87.3,70.25 180 top
LED47  83.3,70.25 180 top
LED48  79.3,70.25 180 top
LED49  75.3,70.25 180 top
LED50  71.3,70.25 180 top
LED51  67.3,70.25 180 top
LED52  63.3,70.25 180 top
LED53  59.3,70.25 180 top
LED54  55.3,70.25 180 top
LED55  51.3,70.25 180 top
LED56  47.3,70.25 180 top
LED57  43.3,69.62 180 top
LED58  39.3,68.03 180 top
LED59  35.3,65.17 180 top
LED60  31.3,61.05 180 top
R1  136.52,55.01 180 top
R2  136.52,51.84 180 top
R3  136.52,48.66 180 top
R4  136.52,45.49 180 top
R5  44.45,42.31 0 top
R6  44.45,48.98 0 top
R7  44.45,53.42 0 top
R8  44.45,46.76 0 top
R9  44.45,44.53 0 top
R10  44.45,40.09 0 top
R11  44.45,51.2 0 top
R12  44.45,55.65 0 top
R13  136.52,42.31 180 top
R14  136.52,39.14 180 top
R15  31.74,48.03 0 top
R16  31.3,39.45 90 top
R17  35.3,35.33 90 top
R18  39.3,32.79 90 top
R19  43.3,31.52 90 top
R20  47.3,30.88 90 top
R21  51.3,30.88 90 top
R22  55.3,30.88 90 top
R23  59.3,30.88 90 top
R24  63.3,30.88 90 top
R25  67.3,30.88 90 top
R26  71.3,30.88 90 top
R27  75.3,30.88 90 top
R28  79.3,30.88 90 top
R29  83.3,30.88 90 top
R30  87.3,30.88 90 top
R31  91.3,30.88 90 top
R32  95.3,30.88 90 top
R33  99.3,30.88 90 top
R34  103.3,30.88 90 top
R35  107.3,30.88 90 top
R36  111.3,30.88 90 top
R37  115.3,30.88 90 top
R38  119.3,30.88 90 top
R39  123.3,30.88 90 top
R40  127.3,30.88 90 top
R41  131.3,31.52 90 top
R42  135.3,33.42 90 top
R43  139.3,35.64 90 top
R44  143.3,39.77 90 top
R45  142.55,48.03 180 top
R46  143.3,56.28 270 top
R47  139.3,60.41 270 top
R48  135.3,62.95 270 top
R49  131.3,64.54 270 top
R50  127.3,65.49 270 top
R51  123.3,65.49 270 top
R52  119.3,65.49 270 top
R53  115.3,65.49 270 top
R54  111.3,65.49 270 top
R55  107.3,65.49 270 top
R56  103.3,65.49 270 top
R57  99.3,65.49 270 top
R58  95.3,65.49 270 top
R59  91.3,65.49 270 top
R60  87.3,65.49 270 top
R61  83.3,65.49 270 top
R62  79.3,65.49 270 top
R63  75.3,65.49 270 top
R64  71.3,65.49 270 top
R65  67.3,65.49 270 top
R66  63.3,65.49 270 top
R67  59.3,65.49 270 top
R68  55.3,65.49 270 top
R69  51.3,65.49 270 top
R70  47.3,65.49 270 top
R71  43.3,64.86 270 top
R72  39.3,63.27 270 top
R73  35.3,60.41 270 top
R74  31.3,56.28 270 top
T1  132.07,55.97 90 top
T2  132.07,52.79 90 top
T3  132.07,49.62 90 top
T4  132.07,46.44 90 top
T5  132.07,43.27 90 top
T6  132.07,40.09 90 top
TP1  28.25,20.41 180 top
TP2  31.43,20.41 0 top
TP3  35.24,20.41 0 top
TP4  39.37,20.41 0 top
TP5  43.17,20.41 0 top
TP6  47.3,20.41 0 top
TP7  51.43,20.41 0 top
TP8  55.24,20.41 0 top
TP9  59.05,20.41 0 top
TP10  63.18,20.41 0 top
TP11  67.31,20.41 0 top
TP12  71.43,20.41 0 top
TP13  75.24,20.41 0 top
TP14  79.37,20.41 0 top
TP15  83.18,20.41 0 top
TP16  87.31,20.41 0 top
TP17  91.44,20.41 0 top
TP18  95.25,20.41 0 top
TP19  99.06,20.41 0 top
TP20  103.5,20.41 0 top
TP21  107.31,20.41 0 top
TP22  111.12,20.41 0 top
TP23  115.25,20.41 0 top
TP24  119.38,20.41 0 top
TP25  123.19,20.41 0 top
TP26  127.31,20.41 0 top
TP27  131.44,20.41 0 top
TP28  135.25,20.41 0 top
TP29  139.38,20.41 0 top
TP30  143.19,20.41 0 top
TP31  152.08,48.03 270 top
TP32  143.19,75.65 0 top
TP33  139.38,75.65 0 top
TP34  135.25,75.65 0 top
TP35  131.44,75.65 0 top
TP36  127.31,75.65 0 top
TP37  123.5,75.65 0 top
TP38  119.38,75.65 0 top
TP39  115.25,75.65 0 top
TP40  111.44,75.65 0 top
TP41  107.31,75.65 0 top
TP42  103.5,75.65 0 top
TP43  99.37,75.65 0 top
TP44  95.25,75.65 0 top
TP45  91.44,75.65 0 top
TP46  87.31,75.65 0 top
TP47  83.18,75.65 0 top
TP48  79.37,75.65 0 top
TP49  75.24,75.65 0 top
TP50  71.43,75.65 0 top
TP51  67.31,75.65 0 top
TP52  63.5,75.65 0 top
TP53  59.37,75.65 0 top
TP54  55.56,75.65 0 top
TP55  51.43,75.65 0 top
TP56  47.3,75.65 0 top
TP57  43.17,75.65 0 top
TP58  39.37,75.65 0 top
TP59  35.24,75.65 0 top
TP60  31.43,75.65 0 top
TP61  39.37,48.98 90 top
TP62  39.37,53.42 90 top
TP63  39.37,46.76 90 top
TP64  39.37,40.09 90 top
TP65  39.37,51.2 90 top
TP66  39.37,55.65 90 top
TP67  39.37,42.31 90 top
TP68  152.08,55.33 270 top
TP69  152.08,53.11 270 top
TP70  152.08,50.57 90 top
TP71  152.08,45.17 90 top
TP72  152.08,42.95 90 top
TP73  152.08,40.73 90 top
TP74  136.52,58.82 0 top
TP75  135.25,36.91 90 top
TP76  39.37,44.53 90 top

### Tracks (layer width: path | path; a pad name or v marks a point on that pad's centre or on a via)
+5V  (via drill 1 pad 1.42, 1.1 pad 1.42)  (1 unrouted)
  Top 0.813: 136.52,56.91 T1.E | 136.52,43.9 136.52,40.73 | 136.52,47.08 136.52,43.9 | 136.52,50.25 136.52,47.08 | 136.52,53.42 136.52,50.25 | 136.52,56.91 136.52,53.42 | T6.E 133.18,40.73 136.12,40.73 | 136.52,40.73 136.12,40.73 | T5.E 133.18,43.9 136.52,43.9 | T4.E 133.18,47.08 136.52,47.08 | T3.E 133.18,50.25 136.52,50.25 | T2.E 133.18,53.42 136.52,53.42 | R44.2 142.85,40.73 142.85,41.44 v140.81,41.44 140.81,40.73 136.12,40.73 | 135.3,36.75 135.3,37.05 R43.2 139.3,37.23 136.52,37.23 136.52,40.73 | 135.3,36.75 R42.2 131.3,34.82 R41.2 127.3,32.92 R40.2 R39.2 123.3,32.15 118.74,32.15 118.74,32.28 R38.2 R37.2 R36.2 R35.2 R34.2 R33.2 R32.2 R31.2 R30.2 R29.2 R28.2 R27.2 R26.2 R25.2 R24.2 R23.2 R22.2 R21.2 R20.2 47.3,32.92 R19.2 43.3,34.19 R18.2 39.3,36.73 R17.2 35.3,40.86 R16.2 33.15,40.86 R15.2 | R74.2 35.3,54.88 R73.2 39.3,59.01 R72.2 43.3,61.87 R71.2 47.3,63.45 R70.2 R69.2 R68.2 R67.2 R66.2 R65.2 R64.2 R63.2 R62.2 R61.2 R60.2 R59.2 R58.2 R57.2 R56.2 R55.2 R54.2 R53.2 R52.2 R51.2 R50.2 127.3,63.14 R49.2 131.3,61.55 R48.2 136.52,61.55 136.52,56.91 | R47.2 136.52,59.01 136.52,56.91 | TP75.1 135.25,36.75 135.3,36.75 | R46.2 143.3,53.31 v140.5,53.31 140.5,53.42 136.52,53.42 | 136.52,47.08 136.52,47.06 v139.88,47.06 141.15,47.06 R45.2
DIS0
  Top 0.813: R1.1 140.65,55.01 140.65,56.28 148.59,56.28 148.59,55.33 TP68.1
DIS1
  Top 0.813: R2.1 148.59,51.84 148.59,53.11 TP69.1
DIS2
  Top 0.813: R3.1 137.94,50.25 152.08,50.25 TP70.1
DIS3
  Top 0.813: R4.1 152.08,45.49 TP71.1
DIS4
  Top 0.813: R13.1 137.94,43.58 152.08,43.58 TP72.1
DIS5
  Top 0.813: R14.1 137.94,39.77 145.09,39.77 | 145.09,39.77 149.85,39.77 | TP73.1 152.08,39.77 145.09,39.77
LED1
  Top 0.813: LED1.C 25.63,45.17 28.25,45.17 TP1.1
LED2
  Top 0.813: LED2.C 31.3,20.41 TP2.1
LED3
  Top 0.813: TP3.1 35.24,29.21 LED3.C
LED4
  Top 0.813: TP4.1 39.37,26.68 LED4.C
LED5
  Top 0.813: TP5.1 43.17,25.41 LED5.C
LED6
  Top 0.813: TP6.1 LED6.C
LED7
  Top 0.813: TP7.1 51.43,24.77 LED7.C
LED8
  Top 0.813: TP8.1 55.24,24.77 LED8.C
LED9
  Top 0.813: TP9.1 59.05,24.77 LED9.C
LED10
  Top 0.813: TP10.1 63.18,24.77 LED10.C
LED11
  Top 0.813: TP11.1 LED11.C
LED12
  Top 0.813: TP12.1 71.43,24.77 LED12.C
LED13
  Top 0.813: TP13.1 75.24,24.77 LED13.C
LED14
  Top 0.813: TP14.1 79.37,24.77 LED14.C
LED15
  Top 0.813: TP15.1 83.18,24.77 LED15.C
LED16
  Top 0.813: TP16.1 LED16.C
LED17
  Top 0.813: TP17.1 91.44,24.77 LED17.C
LED18
  Top 0.813: TP18.1 95.25,24.77 LED18.C
LED19
  Top 0.813: TP19.1 99.06,24.77 LED19.C
LED20
  Top 0.813: TP20.1 103.5,24.77 LED20.C
LED21
  Top 0.813: TP21.1 LED21.C
LED22
  Top 0.813: TP22.1 111.12,24.77 LED22.C
LED23
  Top 0.813: TP23.1 115.25,24.77 LED23.C
LED24
  Top 0.813: TP24.1 119.38,24.77 LED24.C
LED25
  Top 0.813: TP25.1 123.19,24.77 LED25.C
LED26
  Top 0.813: TP26.1 127.31,24.77 LED26.C
LED27
  Top 0.813: TP27.1 131.44,25.41 LED27.C
LED28
  Top 0.813: TP28.1 135.25,27.31 LED28.C
LED29
  Top 0.813: TP29.1 139.38,29.53 LED29.C
LED30
  Top 0.813: TP30.1 143.19,33.66 LED30.C
LED31
  Top 0.813: LED31.C TP31.1
LED32
  Top 0.813: LED32.C 143.3,75.65 TP32.1
LED33
  Top 0.813: TP33.1 139.38,66.52 LED33.C
LED34
  Top 0.813: LED34.C 135.3,75.65 TP34.1
LED35
  Top 0.813: LED35.C 131.3,75.65 TP35.1
LED36
  Top 0.813: LED36.C TP36.1
LED37
  Top 0.813: LED37.C 123.3,75.65 TP37.1
LED38
  Top 0.813: LED38.C 119.3,75.65 TP38.1
LED39
  Top 0.813: LED39.C 115.3,75.65 TP39.1
LED40
  Top 0.813: LED40.C 111.3,75.65 TP40.1
LED41
  Top 0.813: LED41.C TP41.1
LED42
  Top 0.813: LED42.C 103.3,75.65 TP42.1
LED43
  Top 0.813: LED43.C 99.3,75.65 TP43.1
LED44
  Top 0.813: LED44.C 95.3,75.65 TP44.1
LED45
  Top 0.813: LED45.C 91.3,75.65 TP45.1
LED46
  Top 0.813: LED46.C TP46.1
LED47
  Top 0.813: LED47.C 83.3,75.65 TP47.1
LED48
  Top 0.813: LED48.C 79.3,75.65 TP48.1
LED49
  Top 0.813: LED49.C 75.3,75.65 TP49.1
LED50
  Top 0.813: LED50.C 71.3,75.65 TP50.1
LED51
  Top 0.813: LED51.C TP51.1
LED52
  Top 0.813: TP52.1 63.5,71.6 LED52.C
LED53
  Top 0.813: TP53.1 59.37,71.6 LED53.C
LED54
  Top 0.813: TP54.1 55.56,71.6 LED54.C
LED55
  Top 0.813: TP55.1 51.43,71.6 LED55.C
LED56
  Top 0.813: TP56.1 LED56.C
LED57
  Top 0.813: TP57.1 43.17,70.97 LED57.C
LED58
  Top 0.813: TP58.1 39.37,69.38 LED58.C
LED59
  Top 0.813: TP59.1 35.24,66.52 LED59.C
LED60
  Top 0.813: TP60.1 31.43,62.39 LED60.C
N$1  (via drill 1 pad 1.42)
  Top 0.813: DIS1.8 53.65,53.42 v53.02,53.42 | v53.02,42.63 53.65,42.63 DIS1.3 53.65,50.57 128.58,50.57 128.58,55.97 T1.C
  Bottom 0.813: v53.02,53.42 v53.02,42.63
N$2
  Top 0.813: R16.1 LED2.A
N$3  (via drill 1 pad 1.42)
  Top 0.813: DIS2.8 66.35,53.42 v65.72,53.42 | v65.72,42.63 66.35,42.63 | 66.35,42.63 DIS2.3 | T2.C 129.53,52.79 129.53,49.62 66.35,49.62 66.35,42.63
  Bottom 0.813: v65.72,53.42 v65.72,42.63
N$4
  Top 0.813: 27.94,48.03 LED1.A R15.1
N$5
  Top 0.813: T4.B R4.2
N$6
  Top 0.813: T3.B R3.2
N$7
  Top 0.813: T2.B R2.2
N$8
  Top 0.813: R1.2 T1.B
N$9  (via drill 1 pad 1.42)
  Top 0.813: DIS3.8 81.59,53.42 v80.96,53.42 | v80.96,42.63 81.59,42.63 81.59,41.99 | 81.59,41.99 DIS3.3 | T3.C 130.97,48.67 81.59,48.67 81.59,41.99
  Bottom 0.813: v80.96,53.42 v80.96,42.63
N$10
  Top 0.762: DIS6.7 119.69,51.84 110.8,51.84 110.8,57.55 106.99,57.55 DIS5.7 106.99,51.84 95.56,51.84 95.56,57.55 91.75,57.55 DIS4.7 91.75,51.84 82.86,51.84 82.86,57.55 79.05,57.55 DIS3.7 79.05,51.84 67.62,51.84 67.62,57.55 63.81,57.55 DIS2.7 63.81,51.84 54.92,51.84 54.92,57.55 51.11,57.55 DIS1.7
  Top 0.813: R6.2 51.11,48.98 DIS1.7
N$11
  Top 0.762: DIS6.4 119.69,44.22 110.8,44.22 110.8,38.5 106.99,38.5 DIS5.4 106.99,44.22 95.56,44.22 95.56,38.5 91.75,38.5 DIS4.4 91.75,44.22 82.86,44.22 82.86,38.5 79.05,38.5 DIS3.4 79.05,44.22 67.62,44.22 67.62,38.5 63.81,38.5 DIS2.4 63.81,44.22 54.92,44.22 54.92,38.5 51.11,38.5 51.11,39.77 DIS1.4
  Top 0.813: R8.2 51.11,46.76 51.11,39.77
N$12
  Top 0.762: DIS6.6 117.15,53.74 113.34,53.74 113.34,59.46 104.45,59.46 DIS5.6 104.45,53.74 98.1,53.74 98.1,59.46 89.21,59.46 DIS4.6 89.21,53.74 85.4,53.74 85.4,59.46 76.51,59.46 DIS3.6 76.51,53.74 70.16,53.74 70.16,59.46 61.27,59.46 DIS2.6 61.27,53.74 57.46,53.74 57.46,59.46 48.57,59.46 48.57,56.6 DIS1.6
  Top 0.813: 48.57,56.6 48.57,58.19 | R7.2 48.57,53.42 DIS1.6
N$13
  Top 0.762: DIS6.2 124.77,37.55 118.42,37.55 118.42,43.27 112.07,43.27 DIS5.2 112.07,37.55 105.72,37.55 105.72,43.27 96.83,43.27 DIS4.2 96.83,37.55 90.48,37.55 90.48,43.27 84.13,43.27 DIS3.2 84.13,37.55 77.78,37.55 77.78,43.27 68.89,43.27 DIS2.2 68.89,37.55 62.54,37.55 62.54,43.27 56.19,43.27 DIS1.2
  Top 0.813: R9.2 49.84,44.53 49.84,37.55 56.19,37.55 DIS1.2
N$14
  Top 0.762: DIS6.1 127.31,35.64 114.61,35.64 | DIS1.1 58.73,35.64 69.84,35.64 | 114.61,35.64 DIS5.1 | 99.37,35.64 114.61,35.64 | 99.37,35.64 DIS4.1 | 99.37,35.64 86.67,35.64 | 86.67,35.64 DIS3.1 | 86.67,35.64 69.84,35.64 | DIS2.1 71.43,35.64 69.84,35.64
  Top 0.813: R10.2 45.87,35.64 58.73,35.64
N$15
  Top 0.762: DIS6.9 124.77,59.14 118.42,59.14 118.42,52.79 112.07,52.79 DIS5.9 112.07,58.51 105.72,58.51 105.72,52.79 96.83,52.79 DIS4.9 96.83,58.51 90.48,58.51 90.48,52.79 84.13,52.79 DIS3.9 84.13,58.51 77.78,58.51 77.78,52.79 68.89,52.79 DIS2.9 68.89,58.51 62.54,58.51 62.54,52.79 56.19,52.79 56.19,55.01 DIS1.9
  Top 0.813: 56.19,55.01 56.19,58.51 49.84,58.51 49.84,51.2 R11.2
N$16
  Top 0.762: 114.61,60.41 DIS5.10 | 114.61,60.41 127.31,60.41 DIS6.10 | DIS4.10 99.37,60.41 99.69,60.41 | 99.69,60.41 114.61,60.41 | DIS3.10 86.67,60.41 86.99,60.41 | 86.99,60.41 99.69,60.41 | DIS1.10 58.73,60.41 77.15,60.41 | 77.15,60.41 86.99,60.41 | DIS2.10 71.43,60.41 77.15,60.41
  Top 0.813: R12.2 45.87,60.41 58.73,60.41
N$18  (via drill 1 pad 1.42)
  Top 0.813: DIS4.8 94.29,53.42 v93.66,53.42 | 94.29,42.63 v93.66,42.63 | DIS4.3 94.29,42.63 | T4.C 130.97,47.4 94.29,47.4 94.29,42.63
  Bottom 0.813: v93.66,42.63 v93.66,53.42
N$19
  Top 0.762: DIS6.5 117.15,42.31 113.34,42.31 113.34,36.6 104.45,36.6 DIS5.5 104.45,42.31 98.1,42.31 98.1,36.6 89.21,36.6 DIS4.5 89.21,42.31 85.4,42.31 85.4,36.6 76.51,36.6 DIS3.5 76.51,42.31 70.16,42.31 70.16,36.6 61.27,36.6 DIS2.5 61.27,42.31 57.46,42.31 57.46,36.6 48.57,36.6 DIS1.5
  Top 0.813: R5.2 48.57,42.31 DIS1.5
N$20
  Top 0.813: T6.B R14.2
N$21
  Top 0.813: T5.B R13.2
N$22
  Top 0.813: R17.1 LED3.A
N$23  (via drill 1 pad 1.42)
  Top 0.813: DIS5.8 109.53,53.42 v108.9,53.42 | v108.9,42.63 109.53,42.63 109.53,41.68 | DIS5.3 109.53,41.68 | T5.C 129.53,43.27 129.53,45.2 109.53,45.2 109.53,41.68
  Bottom 0.813: v108.9,42.63 v108.9,53.42
N$24
  Top 0.813: R18.1 LED4.A
N$25  (via drill 1 pad 1.42)
  Top 0.813: DIS6.8 122.23,53.42 v121.6,53.42 | v121.6,42.63 122.23,42.63 122.23,42.31 | DIS6.3 122.23,42.31 | T6.C 128.58,40.09 128.58,44.25 122.23,44.25 122.23,42.31
  Bottom 0.813: v121.6,42.63 v121.6,53.42
N$26
  Top 0.813: R19.1 LED5.A
N$27
  Top 0.813: R20.1 LED6.A
N$28
  Top 0.813: R21.1 LED7.A
N$29
  Top 0.813: R22.1 LED8.A
N$30
  Top 0.813: R23.1 LED9.A
N$31
  Top 0.813: R24.1 LED10.A
N$32
  Top 0.813: R25.1 LED11.A
N$33
  Top 0.813: R26.1 LED12.A
N$34
  Top 0.813: R27.1 LED13.A
N$35
  Top 0.813: R28.1 LED14.A
N$36
  Top 0.813: R29.1 LED15.A
N$37
  Top 0.813: R30.1 LED16.A
N$38
  Top 0.813: R31.1 LED17.A
N$39
  Top 0.813: R32.1 LED18.A
N$40
  Top 0.813: R33.1 LED19.A
N$41
  Top 0.813: R34.1 LED20.A
N$42
  Top 0.813: R35.1 LED21.A
N$43
  Top 0.813: LED22.A R36.1
N$44
  Top 0.813: LED23.A R37.1
N$45
  Top 0.813: LED24.A R38.1
N$46
  Top 0.813: LED25.A R39.1
N$47
  Top 0.813: LED26.A R40.1
N$48
  Top 0.813: R41.1 LED27.A
N$49
  Top 0.813: LED28.A R42.1
N$50
  Top 0.813: LED29.A R43.1
N$51
  Top 0.813: LED30.A R44.1
N$52
  Top 0.813: R45.1 LED31.A
N$53
  Top 0.813: 143.19,59.46 143.3,59.46 LED32.A R46.1
N$54
  Top 0.813: R47.1 LED33.A
N$55
  Top 0.813: R48.1 LED34.A
N$56
  Top 0.813: R49.1 LED35.A
N$57
  Top 0.813: R50.1 LED36.A
N$58
  Top 0.813: R51.1 LED37.A
N$59
  Top 0.813: R52.1 LED38.A
N$60
  Top 0.813: R53.1 LED39.A
N$61
  Top 0.813: R54.1 LED40.A
N$62
  Top 0.813: R55.1 LED41.A
N$63
  Top 0.813: R56.1 LED42.A
N$64
  Top 0.813: R57.1 LED43.A
N$65
  Top 0.813: R58.1 LED44.A
N$66
  Top 0.813: R59.1 LED45.A
N$67
  Top 0.813: R60.1 LED46.A
N$68
  Top 0.813: R61.1 LED47.A
N$69
  Top 0.813: R62.1 LED48.A
N$70
  Top 0.813: R63.1 LED49.A
N$71
  Top 0.813: R64.1 LED50.A
N$72
  Top 0.813: LED51.A R65.1
N$73
  Top 0.813: LED52.A R66.1
N$74
  Top 0.813: LED53.A R67.1
N$75
  Top 0.813: LED54.A R68.1
N$76
  Top 0.813: LED55.A R69.1
N$77
  Top 0.813: LED56.A R70.1
N$78
  Top 0.813: LED57.A R71.1
N$79
  Top 0.813: LED58.A R72.1
N$80
  Top 0.813: LED59.A R73.1
N$81
  Top 0.813: LED60.A R74.1
SEG0
  Top 0.813: R6.1 TP61.1
SEG1
  Top 0.813: R7.1 TP62.1
SEG2
  Top 0.813: R8.1 TP63.1
SEG3
  Top 0.813: R9.1 TP76.1
SEG4
  Top 0.813: R10.1 TP64.1
SEG5
  Top 0.813: R11.1 TP65.1
SEG6
  Top 0.813: R12.1 TP66.1
SEG7
  Top 0.813: R5.1 TP67.1